# Altium schematic sheet PowerSupply.SchDoc
size A4
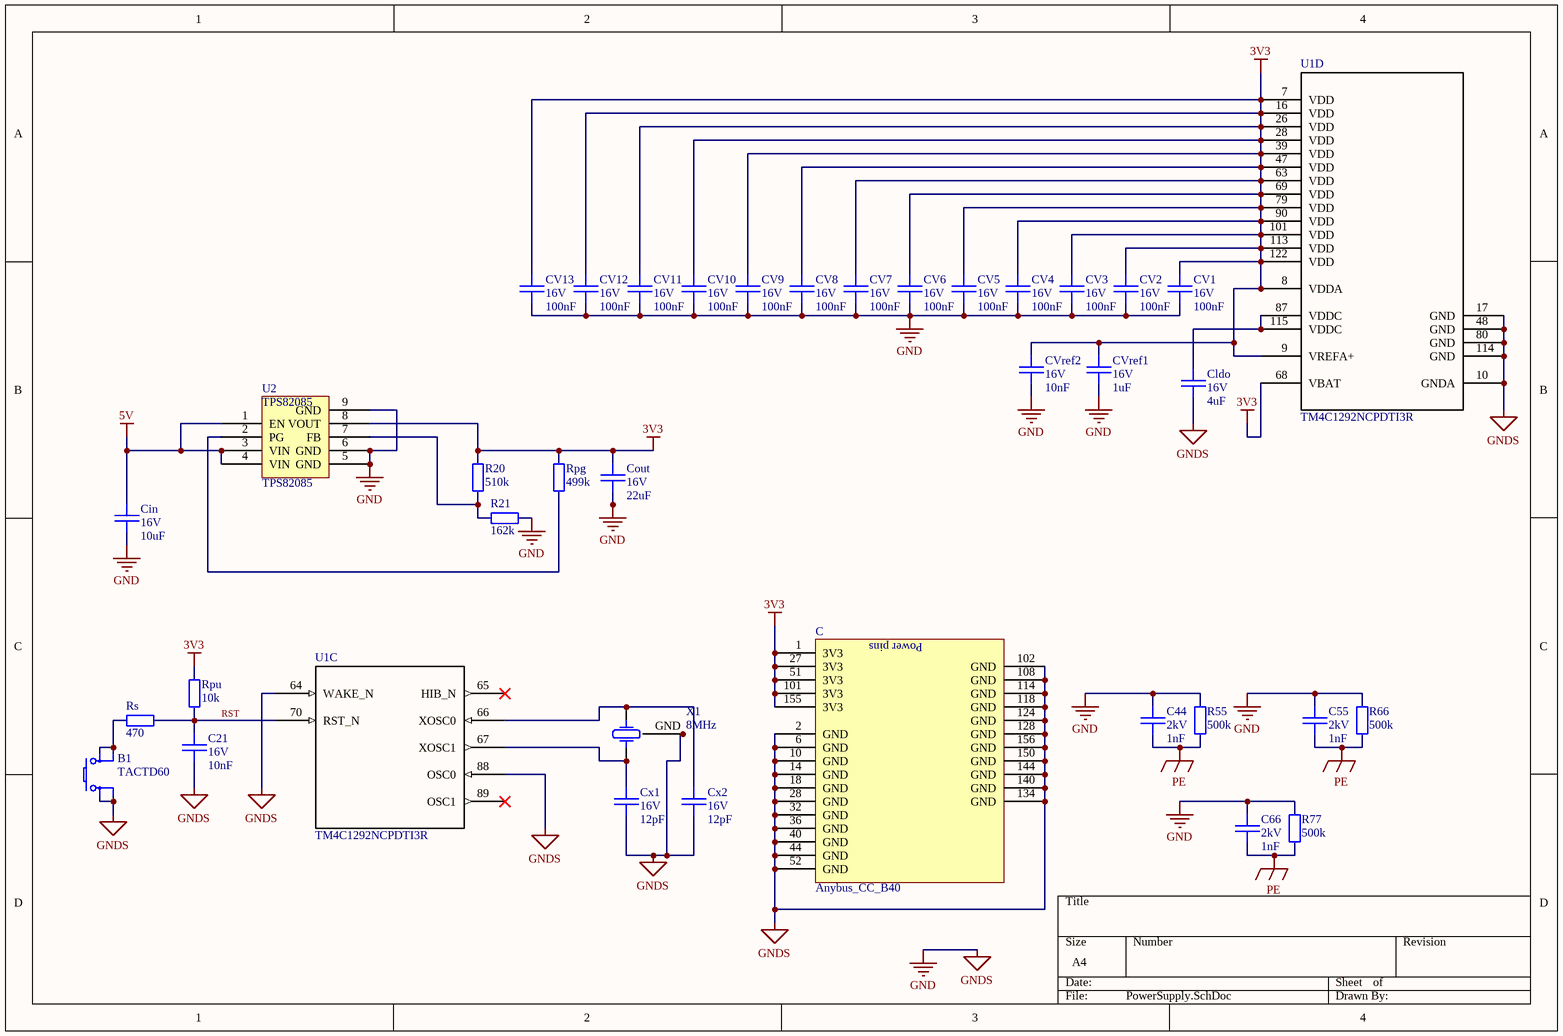
[diagram p0: PowerSupply.SchDoc]

## Parts
?  Anybus_CC_B40  [Anybus-CC-B40]  (part C of 3)
B1  Symbol: TACTD60  [_B_TACTD50]  (hidden comment: B_TACTD60)
C21  value 10nF  Voltage: 16V  [0603 HighDensity]  (hidden comment: 100n)
C44  value 1nF  Voltage: 2kV  [0603 HighDensity]  (hidden comment: 100n)
C55  value 1nF  Voltage: 2kV  [0603 HighDensity]  (hidden comment: 100n)
C66  value 1nF  Voltage: 2kV  [0603 HighDensity]  (hidden comment: 100n)
Cin  value 10uF  Voltage: 16V  [0603 HighDensity]  (hidden comment: 100n)
Cldo  value 4uF  Voltage: 16V  [0603 HighDensity]  (hidden comment: 100n)
Cout  value 22uF  Voltage: 16V  [0603 HighDensity]  (hidden comment: 100n)
CV1  value 100nF  Voltage: 16V  [0603 HighDensity]  (hidden comment: 100n)
CV2  value 100nF  Voltage: 16V  [0603 HighDensity]  (hidden comment: 100n)
CV3  value 100nF  Voltage: 16V  [0603 HighDensity]  (hidden comment: 100n)
CV4  value 100nF  Voltage: 16V  [0603 HighDensity]  (hidden comment: 100n)
CV5  value 100nF  Voltage: 16V  [0603 HighDensity]  (hidden comment: 100n)
CV6  value 100nF  Voltage: 16V  [0603 HighDensity]  (hidden comment: 100n)
CV7  value 100nF  Voltage: 16V  [0603 HighDensity]  (hidden comment: 100n)
CV8  value 100nF  Voltage: 16V  [0603 HighDensity]  (hidden comment: 100n)
CV9  value 100nF  Voltage: 16V  [0603 HighDensity]  (hidden comment: 100n)
CV10  value 100nF  Voltage: 16V  [0603 HighDensity]  (hidden comment: 100n)
CV11  value 100nF  Voltage: 16V  [0603 HighDensity]  (hidden comment: 100n)
CV12  value 100nF  Voltage: 16V  [0603 HighDensity]  (hidden comment: 100n)
CV13  value 100nF  Voltage: 16V  [0603 HighDensity]  (hidden comment: 100n)
CVref1  value 1uF  Voltage: 16V  [0603 HighDensity]  (hidden comment: 100n)
CVref2  value 10nF  Voltage: 16V  [0603 HighDensity]  (hidden comment: 100n)
Cx1  value 12pF  Voltage: 16V  [0603 HighDensity]  (hidden comment: 100n)
Cx2  value 12pF  Voltage: 16V  [0603 HighDensity]  (hidden comment: 100n)
R20  510k  [0603_R HighDensity]
R21  162k  [0603_R HighDensity]
R55  500k  [0603_R HighDensity]
R66  500k  [0603_R HighDensity]
R77  500k  [0603_R HighDensity]
Rpg  499k  [0603_R HighDensity]
Rpu  10k  [0603_R HighDensity]
Rs  470  [0603_R HighDensity]
U1  TM4C1292NCPDTI3R  [PDT0128A_N]  (parts C,D of 7)
U2  TPS82085  [uSIP-8]
X1  8MHz  [_X_ CFPX-180]

## Nets
3V3: ?.1(3V3) ?.27(3V3) ?.51(3V3) ?.101(3V3) ?.155(3V3) Cout.1 CV1.1 CV2.1 CV3.1 CV4.1 CV5.1 CV6.1 CV7.1 CV8.1 CV9.1 CV10.1 CV11.1 CV12.1 CV13.1 CVref1.1 CVref2.1 R20.2 Rpg.2 Rpu.2 U1.7(VDD) U1.8(VDDA) U1.9(VREFA+) U1.16(VDD) U1.26(VDD) U1.28(VDD) U1.39(VDD) U1.47(VDD) U1.63(VDD) U1.68(VBAT) U1.69(VDD) U1.79(VDD) U1.90(VDD) U1.101(VDD) U1.113(VDD) U1.122(VDD) U2.8(VOUT)
5V: Cin.1 U2.1(EN) U2.3(VIN) U2.4(VIN)
GND: ?.2(GND) ?.6(GND) ?.10(GND) ?.14(GND) ?.18(GND) ?.28(GND) ?.32(GND) ?.36(GND) ?.40(GND) ?.44(GND) ?.52(GND) ?.102(GND) ?.108(GND) ?.114(GND) ?.118(GND) ?.124(GND) ?.128(GND) ?.134(GND) ?.140(GND) ?.144(GND) ?.150(GND) ?.156(GND) B1.1 B1.2 C21.2 C44.1 C55.1 C66.1 Cin.2 Cldo.2 Cout.2 CV1.2 CV2.2 CV3.2 CV4.2 CV5.2 CV6.2 CV7.2 CV8.2 CV9.2 CV10.2 CV11.2 CV12.2 CV13.2 CVref1.2 CVref2.2 Cx1.2 Cx2.2 R21.1 R55.2 R66.2 R77.2 U1.10(GNDA) U1.17(GND) U1.48(GND) U1.64(WAKE_N) U1.80(GND) U1.88(OSC0) U1.114(GND) U2.5(GND) U2.6(GND) U2.9(GND) X1.GND X1.GND2(GND)  [also labelled GNDS]
PE: C44.2 C55.2 C66.2 R55.1 R66.1 R77.1
RST: C21.1 Rpu.1 Rs.2 U1.70(RST_N)
NetB1_3: B1.3 B1.4 Rs.1
NetCldo_1: Cldo.1 U1.87(VDDC) U1.115(VDDC)
NetCx1_1: Cx1.1 U1.67(XOSC1) X1.1
NetCx2_1: Cx2.1 U1.66(XOSC0) X1.2
NetR20_1: R20.1 R21.2 U2.7(FB)
NetRpg_1: Rpg.1 U2.2(PG)

Not connected (* = marked no-connect by the designer): U1 65(HIB_N)* 89(OSC1)*

## Notes on the sheet
- (in symbol Anybus_CC_B40, part C) Power pins

## Library data of the parts
B1 = B_TACTD60: Tactile Switch 50mA/12VDC 6x6mm; Supplier: Maritex
C21 C44 C55 C66 Cin Cldo Cout CV1-CV13 CVref1 CVref2 Cx1 Cx2 = C_CER: Ceramic Capacitor
R20 R21 R55 R66 R77 Rpg Rpu Rs = R: Resistor
U1 = TM4C1292NCPDTI3R: Imported; Manufacturer: Texas Instruments; CompType: IC; PIN_COUNT: 128; Application_BuildNumber: *; PartNumber: TM4C1292NCPDTI3R; Alternate PartNumber: TM4C1292NCPDTI3; PackageReference: PDT0128A; MountType: SMT; RoHS: Y; RefDes: RefDes; Type: DEV; Value: Value
U2 = TPS82085: 3-A, 0.8-6-V, Step-Down DC/DC Converter
X1 = CFPX180: Crystal Oscillator; pin to pad: 2>3 GND>2 GND2>4